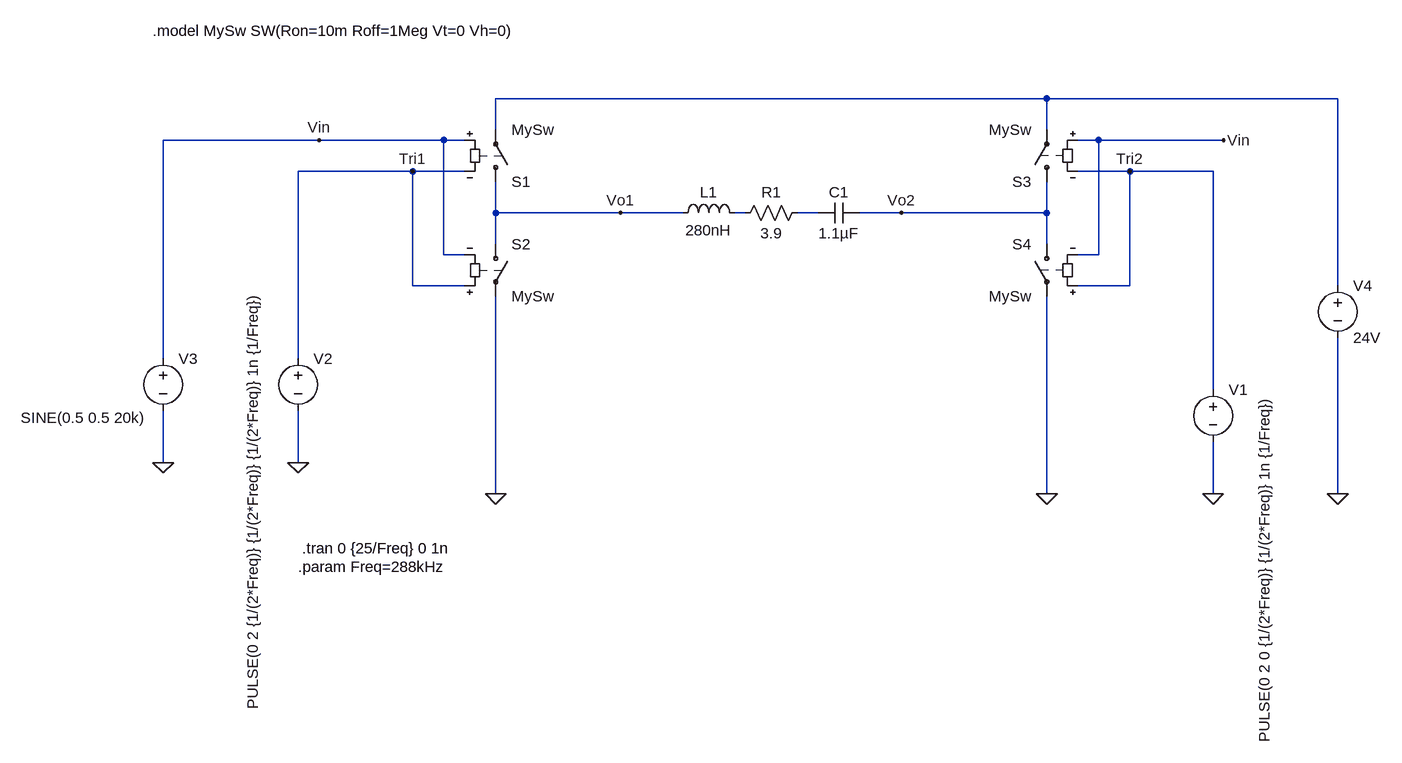
[diagram p0: schematic ultraljud-fyrkant.asc]
ultraljud-fyrkant.asc, the LTspice schematic file:
Version 4
SHEET 1 2024 868
WIRE 1104 -128 256 -128
WIRE 1552 -128 1104 -128
WIRE 256 -80 256 -128
WIRE 1104 -80 1104 -128
WIRE -16 -64 -256 -64
WIRE 176 -64 -16 -64
WIRE 208 -64 176 -64
WIRE 1184 -64 1152 -64
WIRE 1376 -64 1184 -64
WIRE 128 -16 -48 -16
WIRE 208 -16 128 -16
WIRE 1232 -16 1152 -16
WIRE 1360 -16 1232 -16
WIRE 256 48 256 0
WIRE 448 48 256 48
WIRE 544 48 448 48
WIRE 640 48 624 48
WIRE 752 48 720 48
WIRE 880 48 816 48
WIRE 1104 48 1104 0
WIRE 1104 48 880 48
WIRE 256 96 256 48
WIRE 1104 96 1104 48
WIRE 176 112 176 -64
WIRE 208 112 176 112
WIRE 1184 112 1184 -64
WIRE 1184 112 1152 112
WIRE 128 160 128 -16
WIRE 208 160 128 160
WIRE 1232 160 1232 -16
WIRE 1232 160 1152 160
WIRE 1552 160 1552 -128
WIRE -256 272 -256 -64
WIRE -48 272 -48 -16
WIRE 1360 320 1360 -16
WIRE -256 432 -256 352
WIRE -48 432 -48 352
WIRE 256 480 256 176
WIRE 1104 480 1104 176
WIRE 1360 480 1360 400
WIRE 1552 480 1552 240
FLAG 1360 480 0
FLAG -48 432 0
FLAG 128 -16 Tri1
FLAG -256 432 0
FLAG 256 480 0
FLAG 448 48 Vo1
FLAG 1552 480 0
FLAG -16 -64 Vin
FLAG 1232 -16 Tri2
FLAG 1376 -64 Vin
FLAG 1104 480 0
FLAG 880 48 Vo2
SYMBOL res 624 64 R270
WINDOW 0 32 56 VTop 2
WINDOW 3 0 56 VBottom 2
SYMATTR InstName R1
SYMATTR Value 3.9
SYMBOL ind 528 64 R270
WINDOW 0 32 56 VTop 2
WINDOW 3 5 56 VBottom 2
SYMATTR InstName L1
SYMATTR Value 280nH
SYMBOL cap 752 64 R270
WINDOW 0 32 32 VTop 2
WINDOW 3 0 32 VBottom 2
SYMATTR InstName C1
SYMATTR Value 1.1µF
SYMBOL voltage 1360 304 R0
WINDOW 3 79 559 VLeft 2
WINDOW 123 0 0 Left 0
WINDOW 39 0 0 Left 0
SYMATTR InstName V1
SYMATTR Value PULSE(0 2 0 {1/(2*Freq)} {1/(2*Freq)} 1n {1/Freq})
SYMBOL voltage -48 256 R0
WINDOW 3 -70 556 VLeft 2
WINDOW 123 0 0 Left 0
WINDOW 39 0 0 Left 0
SYMATTR InstName V2
SYMATTR Value PULSE(0 2 {1/(2*Freq)} {1/(2*Freq)} {1/(2*Freq)} 1n {1/Freq})
SYMBOL sw 256 16 M180
SYMATTR InstName S1
SYMATTR Value MySw
SYMBOL sw 256 80 R0
SYMATTR InstName S2
SYMATTR Value MySw
SYMBOL voltage -256 256 R0
WINDOW 3 -219 107 Left 2
WINDOW 123 0 0 Left 0
WINDOW 39 0 0 Left 0
SYMATTR InstName V3
SYMATTR Value SINE(0.5 0.5 20k)
SYMBOL voltage 1552 144 R0
WINDOW 123 0 0 Left 0
WINDOW 39 0 0 Left 0
SYMATTR InstName V4
SYMATTR Value 24V
SYMBOL sw 1104 16 R180
SYMATTR InstName S3
SYMATTR Value MySw
SYMBOL sw 1104 80 M0
SYMATTR InstName S4
SYMATTR Value MySw
TEXT -48 592 Left 2 !.param Freq=288kHz
TEXT -42 564 Left 2 !.tran 0 {25/Freq} 0 1n
TEXT -272 -232 Left 2 !.model MySw SW(Ron=10m Roff=1Meg Vt=0 Vh=0)

The netlist it stands for:
* ultraljud-fyrkant.asc
R1 N002 N003 3.9
L1 Vo1 N002 280nH
C1 N003 Vo2 1.1µF
V1 Tri2 0 PULSE(0 2 0 {1/(2*Freq)} {1/(2*Freq)} 1n {1/Freq})
V2 Tri1 0 PULSE(0 2 {1/(2*Freq)} {1/(2*Freq)} {1/(2*Freq)} 1n {1/Freq})
S1 Vo1 N001 Vin Tri1 MySw
S2 Vo1 0 Tri1 Vin MySw
V3 Vin 0 SINE(0.5 0.5 20k)
V4 N001 0 24V
S3 Vo2 N001 Vin Tri2 MySw
S4 Vo2 0 Tri2 Vin MySw
.param Freq=288kHz
.tran 0 {25/Freq} 0 1n
.model MySw SW(Ron=10m Roff=1Meg Vt=0 Vh=0)
.backanno
.end